# Altium schematic sheet GPIO_Expander.SchDoc: fNIRS - GPIO Expander
size A4; CompanyName: UofT Capstone Team 2024991; DrawnBy: Tony Kim; Revision: 1; SheetNumber: 4; SheetTotal: 13
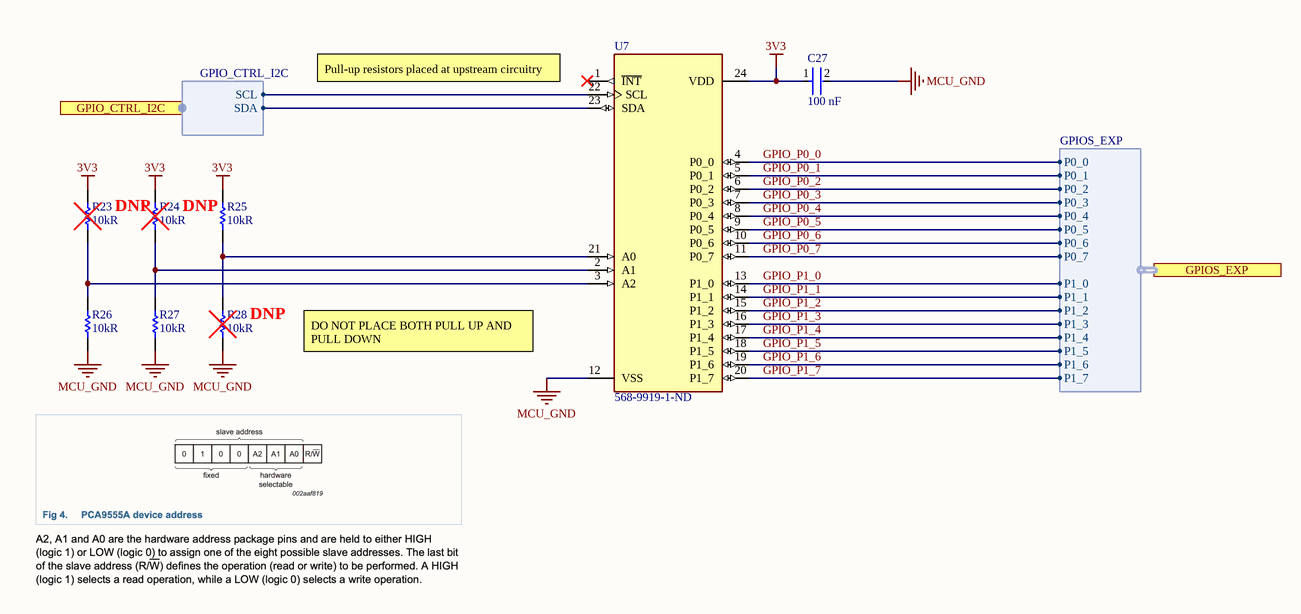
[diagram p0: GPIO_Expander.SchDoc]

## Parts
C27  Capacitance: 100 nF  [FP-CC0603-DA-MFG]  (hidden comment: CC0603KRX7R7BB104)
R23  Resistance: 10kR  [RESC1609X50X30NL8T20]  (hidden comment: CRCW060310K0FKEA)  (no BOM)
R24  Resistance: 10kR  [RESC1609X50X30NL8T20]  (hidden comment: CRCW060310K0FKEA)  (no BOM)
R25  Resistance: 10kR  [RESC1609X50X30NL8T20]  (hidden comment: CRCW060310K0FKEA)
R26  Resistance: 10kR  [RESC1609X50X30NL8T20]  (hidden comment: CRCW060310K0FKEA)
R27  Resistance: 10kR  [RESC1609X50X30NL8T20]  (hidden comment: CRCW060310K0FKEA)
R28  Resistance: 10kR  [RESC1609X50X30NL8T20]  (hidden comment: CRCW060310K0FKEA)  (no BOM)
U7  568-9919-1-ND  [SOP65P640X110-24N]

## Ports
GPIO_CTRL_I2C (harness GPIO_CTRL_I2C, see MCU[5B]), GPIOS_EXP (harness GPIOS_EXP, see MCU[6B])

## Harnesses
GPIO_CTRL_I2C: SCL, SDA
GPIOS_EXP: P0_0, P0_1, P0_2, P0_3, P0_4, P0_5, P0_6, P0_7, P1_0, P1_1, P1_2, P1_3, P1_4, P1_5, P1_6, P1_7

## Nets
3V3: C27.1 R23.2 R24.2 R25.2 U7.24(VDD)
MCU_GND: C27.2 R26.1 R27.1 R28.1 U7.12(VSS)
GPIO_P0_0: U7.4(P0_0) ; port GPIOS_EXP.P0_0
GPIO_P0_1: U7.5(P0_1) ; port GPIOS_EXP.P0_1
GPIO_P0_2: U7.6(P0_2) ; port GPIOS_EXP.P0_2
GPIO_P0_3: U7.7(P0_3) ; port GPIOS_EXP.P0_3
GPIO_P0_4: U7.8(P0_4) ; port GPIOS_EXP.P0_4
GPIO_P0_5: U7.9(P0_5) ; port GPIOS_EXP.P0_5
GPIO_P0_6: U7.10(P0_6) ; port GPIOS_EXP.P0_6
GPIO_P0_7: U7.11(P0_7) ; port GPIOS_EXP.P0_7
GPIO_P1_0: U7.13(P1_0) ; port GPIOS_EXP.P1_0
GPIO_P1_1: U7.14(P1_1) ; port GPIOS_EXP.P1_1
GPIO_P1_2: U7.15(P1_2) ; port GPIOS_EXP.P1_2
GPIO_P1_3: U7.16(P1_3) ; port GPIOS_EXP.P1_3
GPIO_P1_4: U7.17(P1_4) ; port GPIOS_EXP.P1_4
GPIO_P1_5: U7.18(P1_5) ; port GPIOS_EXP.P1_5
GPIO_P1_6: U7.19(P1_6) ; port GPIOS_EXP.P1_6
GPIO_P1_7: U7.20(P1_7) ; port GPIOS_EXP.P1_7
NetR23_1: R23.1 R26.2 U7.3(A2)
NetR24_1: R24.1 R27.2 U7.2(A1)
NetR25_1: R25.1 R28.2 U7.21(A0)
NetU7_22: U7.22(SCL) ; port GPIO_CTRL_I2C.SCL
NetU7_23: U7.23(SDA) ; port GPIO_CTRL_I2C.SDA

Not connected (* = marked no-connect by the designer): U7 1(~{INT})*

## Notes on the sheet
- Pull-up resistors placed at upstream circuitry
- (near R24) DNP
- (near R25) DNP
- (near R28) DNP
- DO NOT PLACE BOTH PULL UP AND PULL DOWN

## Library data of the parts
C27 = CMP-2000-05002-2: CAP CER 0.1UF 16V X7R 0603; Manufacturer: YAGEO; Tolerance: 0.1; Value: 100 nF; Temperature Coefficient: 15%; Material: Ceramic; Voltage Rating: 16 V; Package: CC0603-DA; ComponentLink2Description: Datasheet; Octopart: https://octopart.com/cc0603krx7r7bb104-yageo-192941; Temperature Range High: +125°C; Digikey Description: CAP CER 0.1UF 16V X7R 0603; Voltage: 16 V; Device Class L2: Capacitors; Height: 0.9mm; Temperature: -55°C to +125°C; Manufacturer Part Number: CC0603KRX7R7BB104; Device Class L1: Passive Components; Device Class L3: Ceramic Capacitors; ComponentLink2URL: http://www.yageo.com/documents/recent/UPY-GPHC_X7R_6.3V-to-50V_18.pdf; Footprint Url: http://www.yageo.com/exep/pages/download/literatures/UPY-C_GEN_24.pdf; RoHS: TRUE; Temperature Range Low: -55°C; Temperature Characteristic: X7R; Lead Free: Yes; Category: Cap; Mouser Description: Multilayer Ceramic Capacitor, CC Series, 0.1 - F, - 10%, X7R, 16 V, 0603 [1608 Metric]; Automotive: No
R23-R28 = CMP-1666-00005-4: Chip Resistor, 10 KOhm, +/- 1%, 100 mW, -55 to 155 degC, 0603 (1608 Metric), RoHS, Tape and Reel; Manufacturer: Vishay Semiconductor; Voltage Rating: 75 V; Max Operating Temperature: 155 degC; PackageDescription: 2-Pin Surface Mount Device, Body 1.575 x 0.85 mm; ComponentLink1Description: Manufacturer URL; RoHSCompliant: true; PackageReference: 0603; REACH SVHC: Unknown; Length: 1.55 mm; DatasheetVersion: 06/2012; Packaging: Tape and Reel; Min Operating Temperature: -55 degC; Mounting Technology: Surface Mount; ComponentLink2URL: https://datasheet.ciiva.com/11809/0900766b80d98afc-11809037.pdf; Height: 0.45 mm; ComponentLink2Description: Datasheet; Package Quantity: 5000; ComponentLink1URL: http://www.vishay.com/
U7 = PCA9555APW,118: Parallel I/O Port, 16-Bit, 16 I/O, CMOS, PDSO24; Manufacturer: NXP Semiconductors; Package Body Material: Plastic; Number of Bits: 16; Number of Ports: 2; Package Equivalence Code: TSSOP24,.25; Power Supplies: 1.8/5V; Max Supply Voltage: 5.5V; Min Supply Voltage: 1.65V; Supply Voltage-Nom: 1.8V; Qualification Status: Not Qualified; Supplier 1: Digi-Key; Manufacturer Part Number: PCA9555APW,118; RoHS: Yes; Category: Interface ICs; Stock 1: 2619; Pricing 1: 1=2.30000, 10=2.06600, 25=1.94920, 100=1.66060, 250=1.55924, 500=1.36434, 1000=1.23255 (USD); Package Code: TSSOP; Number of Pins: 24; Package Shape: Rectangular; Min Operating Temperature: -40°C; Max Operating Temperature: 85°C; JESD-30 Code: R-PDSO-G24; Moisture Sensitivity Level: 1; Number of I/O Lines: 16; Package Style: SMALL OUTLINE, THIN PROFILE, SHRINK PITCHMeter; Surface Mount: Yes; Technology: CMOS; Terminal Form: Gull Wing; Terminal Position: DUAL; Length: 7.8mm; Width: 4.4mm; Height - Seated (Max): 1.1mm; Terminal Pitch: 0.65mm; Temperature Grade: INDUSTRIAL; REACH SVHC: Yes; RoHS Compliant: Yes; ComponentLink1URL: https://datasheet.ciiva.com:443/pdfs/VipMasterIC/IC/PHGL/PHGL-S-A0001284358/PHGL-S-A0001284358-1.pdf?src-supplier=IHS+Markit; ComponentLink1Description: https://datasheet.ciiva.com:443/pdfs/VipMasterIC/IC/PHGL/PHGL-S-A0001284358/PHGL-S-A0001284358-1.pdf?src-supplier=IHS+Markit; ComponentLink2URL: https://datasheet.ciiva.com/6633/pca9555a-6633195.pdf?src-supplier=Digi-Key; ComponentLink2Description: https://datasheet.ciiva.com/6633/pca9555a-6633195.pdf?src-supplier=Digi-Key; Supplier Part Number 1: 568-9919-1-ND